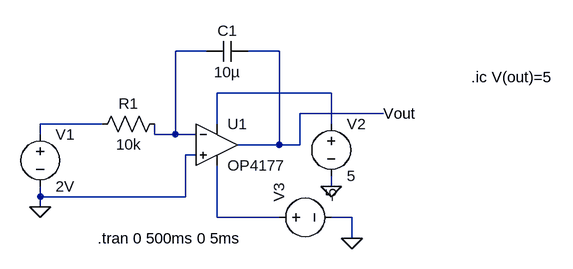
[diagram p0: schematic Draft2.asc]
Draft2.asc, the LTspice schematic file:
Version 4
SHEET 1 880 680
WIRE 208 -16 160 -16
WIRE 320 -16 272 -16
WIRE 400 48 224 48
WIRE 480 80 352 80
WIRE 48 96 -48 96
WIRE 224 96 224 48
WIRE 400 96 400 48
WIRE -48 112 -48 96
WIRE 128 112 128 96
WIRE 160 112 160 -16
WIRE 160 112 128 112
WIRE 192 112 160 112
WIRE 320 128 320 -16
WIRE 320 128 256 128
WIRE 352 128 352 80
WIRE 352 128 320 128
WIRE 192 144 176 144
WIRE 400 192 400 176
WIRE -48 208 -48 192
WIRE 176 208 176 144
WIRE 176 208 -48 208
WIRE -48 224 -48 208
WIRE 224 240 224 160
WIRE 320 240 224 240
WIRE 432 240 400 240
WIRE 432 272 432 240
FLAG -48 224 0
FLAG 400 192 0
FLAG 432 272 0
SYMBOL voltage -48 96 R0
WINDOW 123 0 0 Left 0
WINDOW 39 0 0 Left 0
SYMATTR InstName V1
SYMATTR Value 2V
SYMBOL res 144 80 R90
WINDOW 0 0 56 VBottom 2
WINDOW 3 32 56 VTop 2
SYMATTR InstName R1
SYMATTR Value 10k
SYMBOL cap 272 -32 R90
WINDOW 0 0 32 VBottom 2
WINDOW 3 32 32 VTop 2
SYMATTR InstName C1
SYMATTR Value 10µ
SYMBOL voltage 400 80 R0
WINDOW 123 0 0 Left 0
WINDOW 39 0 0 Left 0
SYMATTR InstName V2
SYMATTR Value 5
SYMBOL OpAmps\\OP4177 224 64 R0
SYMATTR InstName U1
SYMBOL voltage 304 240 R270
WINDOW 123 0 0 Left 0
WINDOW 39 0 0 Left 0
SYMATTR InstName V3
SYMATTR Value -5
TEXT 40 272 Left 2 !.tran 0 500ms 0 5ms
TEXT 616 24 Left 2 !.ic V(out)=5
TEXT 480 80 Left 2 !Vout

The netlist it stands for:
* Draft2.asc
V1 N004 0 2V
R1 N001 N004 10k
C1 N002 N001 10µ
V2 N003 0 5
XU1 0 N001 N003 N005 N002 OP4177  ; pins In+ In- V+ V- OUT
V3 N005 0 -5
.tran 0 500ms 0 5ms
.ic V(out)=5
Vout
.backanno
.end